# Altium project PCB_Project1.PrjPCB
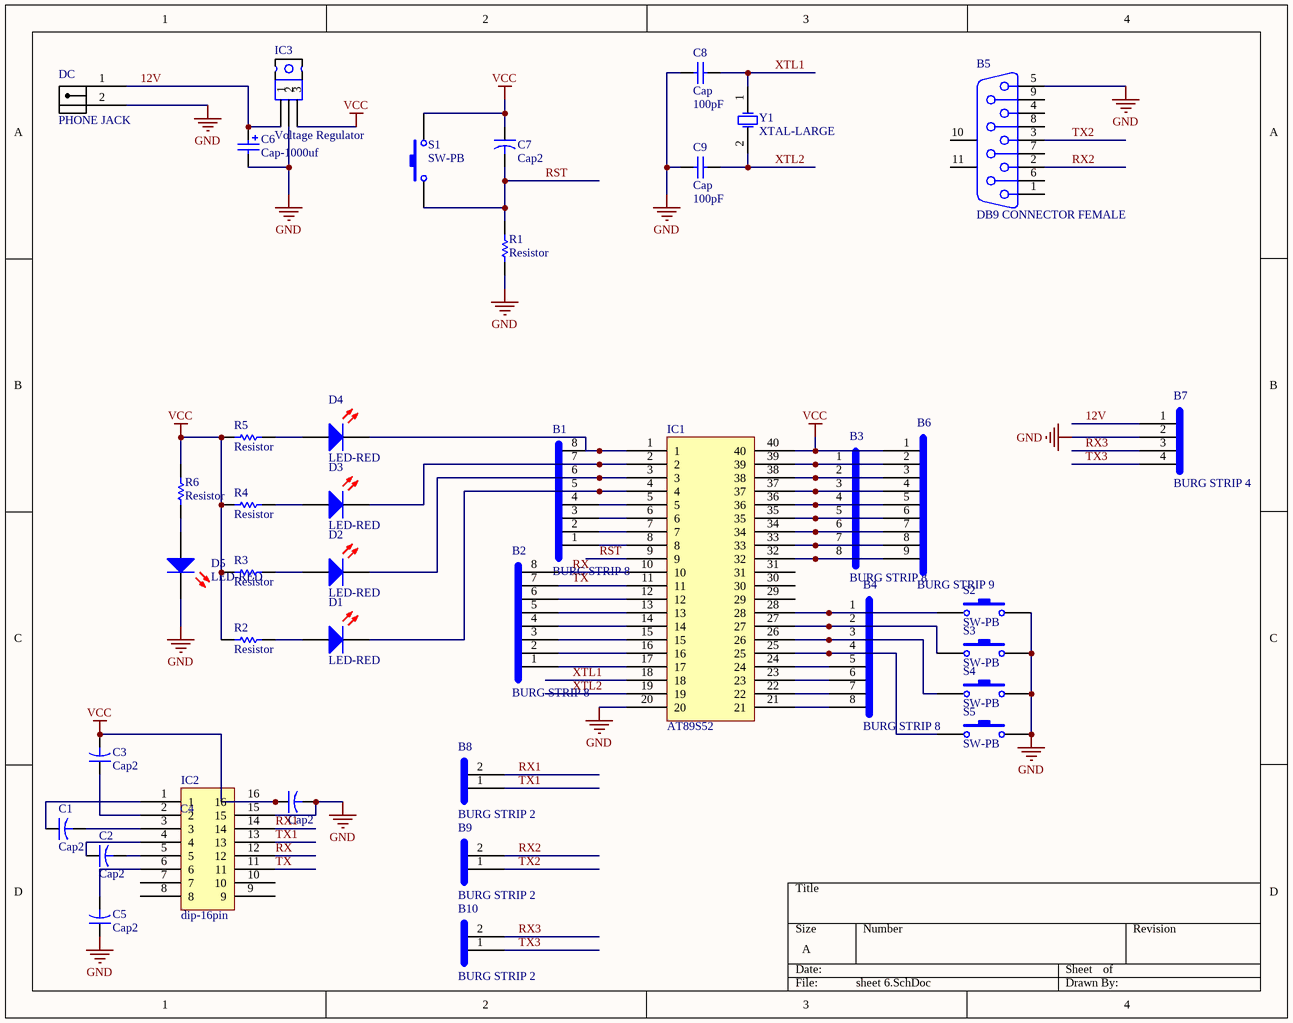
[diagram p0: sheet 6.SchDoc]
1 sheet, 40 parts. Net scope: global (net labels, ports and power ports of the same name join across sheets).
Board file: PCB1.~(11).PcbDoc

## Sheet sheet 6.SchDoc
size A

### Parts
B1  BURG STRIP 8  [bergstrip-8pin]
B2  BURG STRIP 8  [bergstrip-8pin]
B3  BURG STRIP 8  [bergstrip-8pin]
B4  BURG STRIP 8  [bergstrip-8pin]
B5  DB9 CONNECTOR FEMALE  [DB9 CONNECTOR FEMALE]
B6  BURG STRIP 9  [bergstrip-9pin]
B7  BURG STRIP 4  [bergstrip-4pin]
B8  BURG STRIP 2  [bergstrip-2pin]
B9  BURG STRIP 2  [bergstrip-2pin]
B10  BURG STRIP 2  [bergstrip-2pin]
C1  Cap2  [CAP-100uf]
C2  Cap2  [CAP-100uf]
C3  Cap2  [CAP-100uf]
C4  Cap2  [CAP-100uf]
C5  Cap2  [CAP-100uf]
C6  Cap-1000uf  [CAP-1000uf]
C7  Cap2  [CAP-100uf]
C8  Cap  value 100pF  [CAP]
C9  Cap  value 100pF  [CAP]
D1  LED-RED  [LED-RED]
D2  LED-RED  [LED-RED]
D3  LED-RED  [LED-RED]
D4  LED-RED  [LED-RED]
D5  LED-RED  [LED-RED]
DC  PHONE JACK  [PHONE JACK]
IC1  AT89S52  [AT89S52]
IC2  dip-16pin  [dip-16pin]
IC3  Voltage Regulator  [7805 WITH HEAT-SINK]
R1  Resistor  [res-2.54x4]
R2  Resistor  [res-2.54x4]
R3  Resistor  [res-2.54x4]
R4  Resistor  [res-2.54x4]
R5  Resistor  [res-2.54x4]
R6  Resistor  [res-2.54x4]
S1  SW-PB  [sw-pb]
S2  SW-PB  [sw-pb]
S3  SW-PB  [sw-pb]
S4  SW-PB  [sw-pb]
S5  SW-PB  [sw-pb]
Y1  XTAL-LARGE  [XTAL-LARGE]

### Nets
GND: B5.5 B7.2 C4.2 C5.1 C6.2 C8.1 C9.1 D5.2(K) DC.2 IC1.20 IC2.15 IC3.2 R1.1 S2.2 S3.2 S4.2 S5.2
VCC: B6.1 C3.2 C4.1 C7.1 IC1.40 IC2.16 IC3.3 R2.1 R3.1 R4.1 R5.1 R6.2 S1.2
12V: B7.1 C6.1 DC.1 IC3.1
RST: C7.2 IC1.9 R1.2 S1.1
RX: B2.8 IC1.10 IC2.12
RX1: B8.2 IC2.14
RX2: B5.2 B9.2
RX3: B7.3 B10.2
TX: B2.7 IC1.11 IC2.11
TX1: B8.1 IC2.13
TX2: B5.3 B9.1
TX3: B7.4 B10.1
XTL1: C8.2 IC1.18 Y1.1(OSC1)
XTL2: C9.2 IC1.19 Y1.2(OSC2)
NetB1_1: B1.1 IC1.8
NetB1_2: B1.2 IC1.7
NetB1_3: B1.3 IC1.6
NetB1_4: B1.4 IC1.5
NetB1_5: B1.5 D1.2(K) IC1.4
NetB1_6: B1.6 D2.2(K) IC1.3
NetB1_7: B1.7 D3.2(K) IC1.2
NetB1_8: B1.8 D4.2(K) IC1.1
NetB2_1: B2.1 IC1.17
NetB2_2: B2.2 IC1.16
NetB2_3: B2.3 IC1.15
NetB2_4: B2.4 IC1.14
NetB2_5: B2.5 IC1.13
NetB2_6: B2.6 IC1.12
NetB3_1: B3.1 B6.2 IC1.39
NetB3_2: B3.2 B6.3 IC1.38
NetB3_3: B3.3 B6.4 IC1.37
NetB3_4: B3.4 B6.5 IC1.36
NetB3_5: B3.5 B6.6 IC1.35
NetB3_6: B3.6 B6.7 IC1.34
NetB3_7: B3.7 B6.8 IC1.33
NetB3_8: B3.8 B6.9 IC1.32
NetB4_1: B4.1 IC1.28 S2.1
NetB4_2: B4.2 IC1.27 S3.1
NetB4_3: B4.3 IC1.26 S4.1
NetB4_4: B4.4 IC1.25 S5.1
NetB4_5: B4.5 IC1.24
NetB4_6: B4.6 IC1.23
NetB4_7: B4.7 IC1.22
NetB4_8: B4.8 IC1.21
NetC1_1: C1.1 IC2.1
NetC1_2: C1.2 IC2.3
NetC2_1: C2.1 IC2.4
NetC2_2: C2.2 IC2.5
NetC3_1: C3.1 IC2.2
NetC5_2: C5.2 IC2.6
NetD1_1: D1.1(A) R2.2
NetD2_1: D2.1(A) R3.2
NetD3_1: D3.1(A) R4.2
NetD4_1: D4.1(A) R5.2
NetD5_1: D5.1(A) R6.1

Not connected (* = marked no-connect by the designer): B5 1 4 6 7 8 9 10(MH1) 11(MH2); IC1 29 30 31; IC2 7 8 9 10

### Library data of the parts
C8 C9 = Cap: Capacitor; Published: 8-Jun-2000; LatestRevisionDate: 17-Jul-2002; LatestRevisionNote: Re-released for DXP Platform.; PackageReference: RAD-0.3; Publisher: Altium Limited
D1-D5 = LED-RED: Typical BLUE SiC LED; Published: 8-Jun-2000; LatestRevisionDate: 17-Dec-2003; LatestRevisionNote: PCB Footprint replaced.; DatasheetVersion: 16-Apr-2002; PackageVersion: 16-Apr-2002; PackageReference: 3.5X2.8X1.9; Publisher: Altium Limited
IC3 = 7805 HEATSINK
R1-R6 = Resistor 2.54x4
S1-S5 = SW-PB: Switch; Published: 24-Mar-1999; LatestRevisionDate: 17-Jul-2002; LatestRevisionNote: Re-released for DXP Platform.; PackageReference: SPST-2; Publisher: Altium Limited
Y1 = XTAL-LARGE: Crystal Oscillator; Published: 8-Jun-2000; LatestRevisionDate: 17-Jul-2002; LatestRevisionNote: Re-released for DXP Platform.; PackageReference: R38; Publisher: Altium Limited